# EAGLE schematic hodiny (EAGLE 7.6.0)

## Sheet 1 of 2
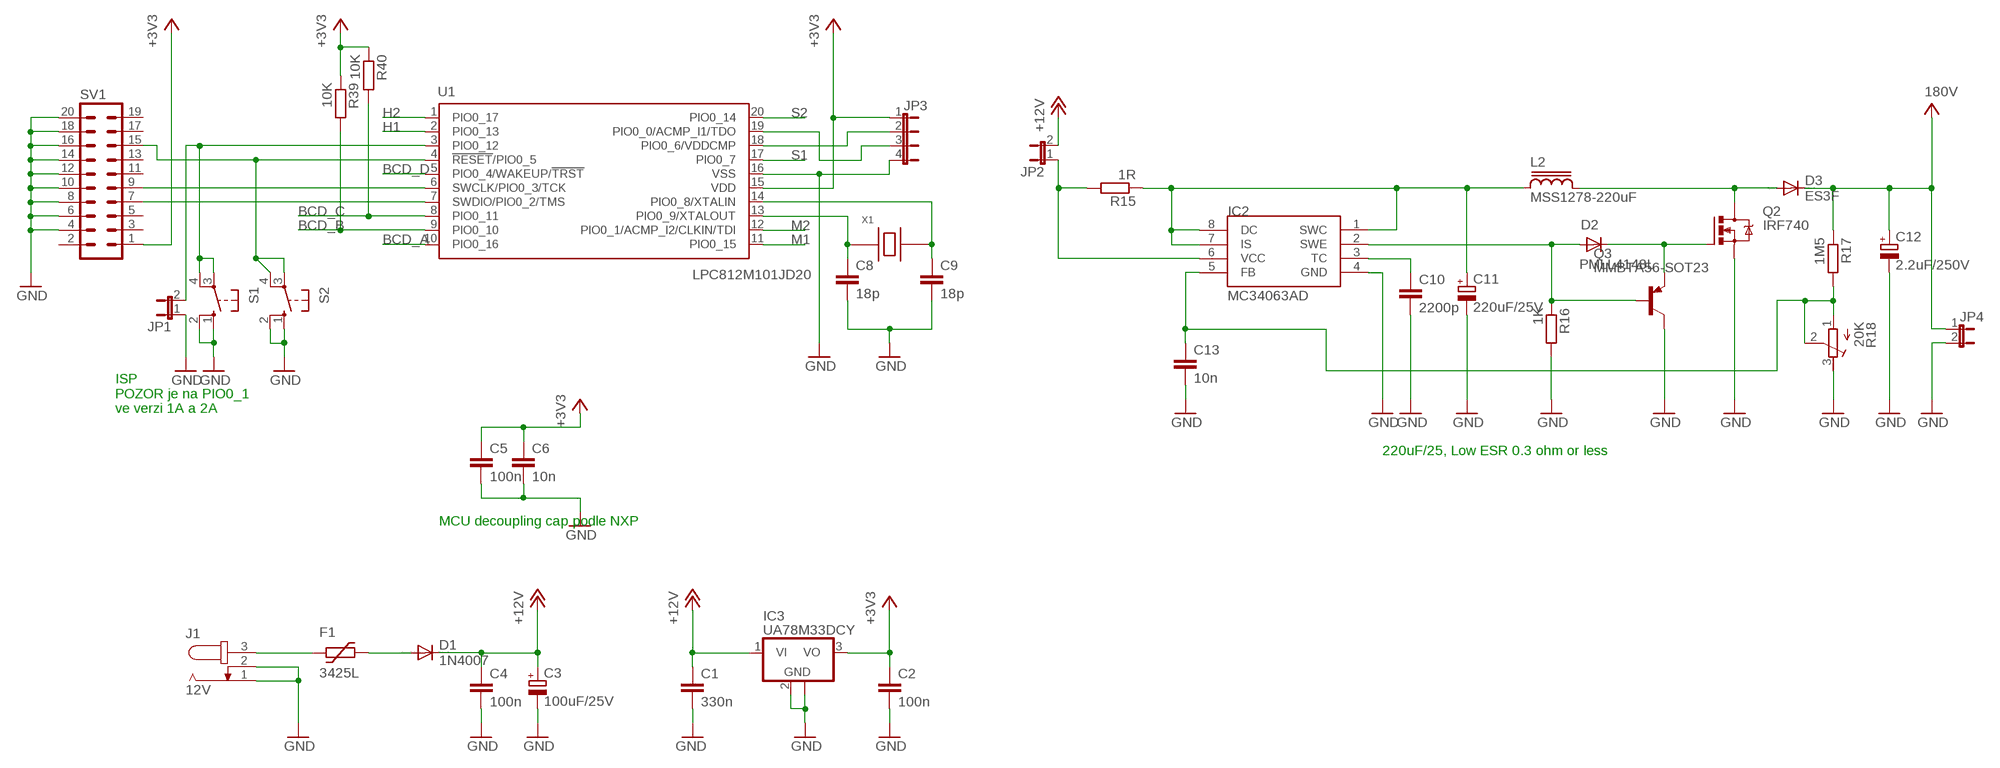
[diagram p0: schematic, sheet 1]

### Parts
C1  330n  C-EUC1206  [C1206]
C2  100n  C-EUC1206  [C1206]
C3  100uF/25V  CPOL-EU153CLV-0605  [153CLV-0605]
C4  100n  C-EUC1206  [C1206]
C5  100n  C-EUC1206  [C1206]
C6  10n  C-EUC1206  [C1206]
C8  18p  C-EUC0805  [C0805]
C9  18p  C-EUC0805  [C0805]
C10  2200p  C-EUC1206  [C1206]
C11  220uF/25V  CPOL-EU153CLV-0605  [153CLV-0605]
C12  2.2uF/250V  CPOL-EUE2.5-6  [E2,5-6]
C13  10n  C-EUC1206  [C1206]
D1  1N4007  DIODE-MELF-MLL41  [MELF-MLL41]
D2  PMLL4148L  [SOD80C]
D3  ES3F  DIODE-SMC  [SMC]
F1  3425L  [3425L]
IC2  MC34063AD  [SOIC8]
IC3  UA78M33DCY  [SOT223]
J1  12V  JACK-PLUG0  [SPC4077]
JP1  JP1E  [JP1]
JP2  JP1E  [JP1]
JP3  JP4E  [JP4]
JP4  JP1E  [JP1]
L2  MSS1278-220uF  MSS1278  [MSS1278]
Q2  IRF740  [TO220BV]
Q3  MMBTA56-SOT23  [SOT23]
R15  1R  R-EU_R1206  [R1206]
R16  1K  R-EU_R1206  [R1206]
R17  1M5  R-EU_R1206  [R1206]
R18  20K  R-TRIMMTSM53YJ  [RTRIMTSM53YJ]
R39  10K  R-EU_R1206  [R1206]
R40  10K  R-EU_R1206  [R1206]
S1  10-XX  [B3F-10XX]
S2  10-XX  [B3F-10XX]
SV1  ML20  [ML20]
U1  LPC812M101JD20  [SOT163-1]
X1  SMCE-5032  [IQG5032B]

### Nets
+3V3: C2.1 C5.1 C6.1 IC3.3(VO) JP3.1 R39.1 R40.1 SV1.1 U1.15(VDD) ; also sheet 2
+12V: C1.1 C3.+ C4.1 D1.C IC3.1(VI) JP2.2
BCD_A: U1.10(PIO0_16) ; also sheet 2
BCD_B: R39.2 U1.9(PIO0_10) ; also sheet 2
BCD_C: R40.2 U1.8(PIO0_11) ; also sheet 2
BCD_D: U1.5(PIO0_4/WAKEUP/!TRST!) ; also sheet 2
GND: C1.2 C2.2 C3.- C4.2 C5.2 C6.2 C8.2 C9.2 C10.2 C11.- C12.- C13.2 IC2.4(GND) IC3.2(GND) IC3.4(GND) J1.1 J1.2 JP1.1 JP3.4 JP4.2 Q2.S Q3.3(C) R16.2 R18.3(E) S1.1(S) S1.2(S1) S2.1(S) S2.2(S1) SV1.4 SV1.6 SV1.8 SV1.10 SV1.12 SV1.14 SV1.16 SV1.18 SV1.20 U1.16(VSS) ; also sheet 2
H1: U1.2(PIO0_13) ; also sheet 2
H2: U1.1(PIO0_17) ; also sheet 2
M1: U1.11(PIO0_15) ; also sheet 2
M2: U1.12(PIO0_1/ACMP_I2/CLKIN/TDI) ; also sheet 2
N$1: F1.P$1 J1.3
N$2: D1.A F1.P$2
N$3: S2.3(P) S2.4(P1) SV1.15 U1.4(!RESET!/PIO0_5)
N$4: JP1.2 S1.3(P) S1.4(P1) U1.3(PIO0_12)
N$5: SV1.9 U1.6(SWCLK/PIO0_3/TCK)
N$6: SV1.7 U1.7(SWDIO/PIO0_2/TMS)
N$7: C9.1 U1.14(PIO0_8/XTALIN) X1.3(PIN2)
N$8: C8.1 U1.13(PIO0_9/XTALOUT) X1.1(PIN1)
N$9: JP3.2 U1.18(PIO0_6/VDDCMP)
N$10: JP3.3 U1.19(PIO0_0/ACMP_I1/TDO)
N$39: C11.+ IC2.1(SWC) IC2.7(IS) IC2.8(DC) L2.1 R15.1
N$40: C10.1 IC2.3(TC)
N$41: D2.1(K) Q2.G Q3.2(E)
N$42: D3.A L2.2 Q2.D
N$43: D2.2(A) IC2.2(SWE) Q3.1(B) R16.1
N$45: IC2.6(VCC) JP2.1 R15.2
N$46: C13.1 IC2.5(FB) R17.2 R18.1(A) R18.2(S)
S1: U1.17(PIO0_7) ; also sheet 2
S2: U1.20(PIO0_14) ; also sheet 2
V+: C12.+ D3.C JP4.1 R17.1 ; supply symbol labelled 180V ; also sheet 2
Unconnected: SV1.2 SV1.3 SV1.5 SV1.11 SV1.13 SV1.17 SV1.19

### Notes on the sheet
- ISP
  POZOR je na PIO0_1
  ve verzi 1A a 2A
- 220uF/25, Low ESR 0.3 ohm or less
- MCU decoupling cap podle NXP

## Sheet 2 of 2
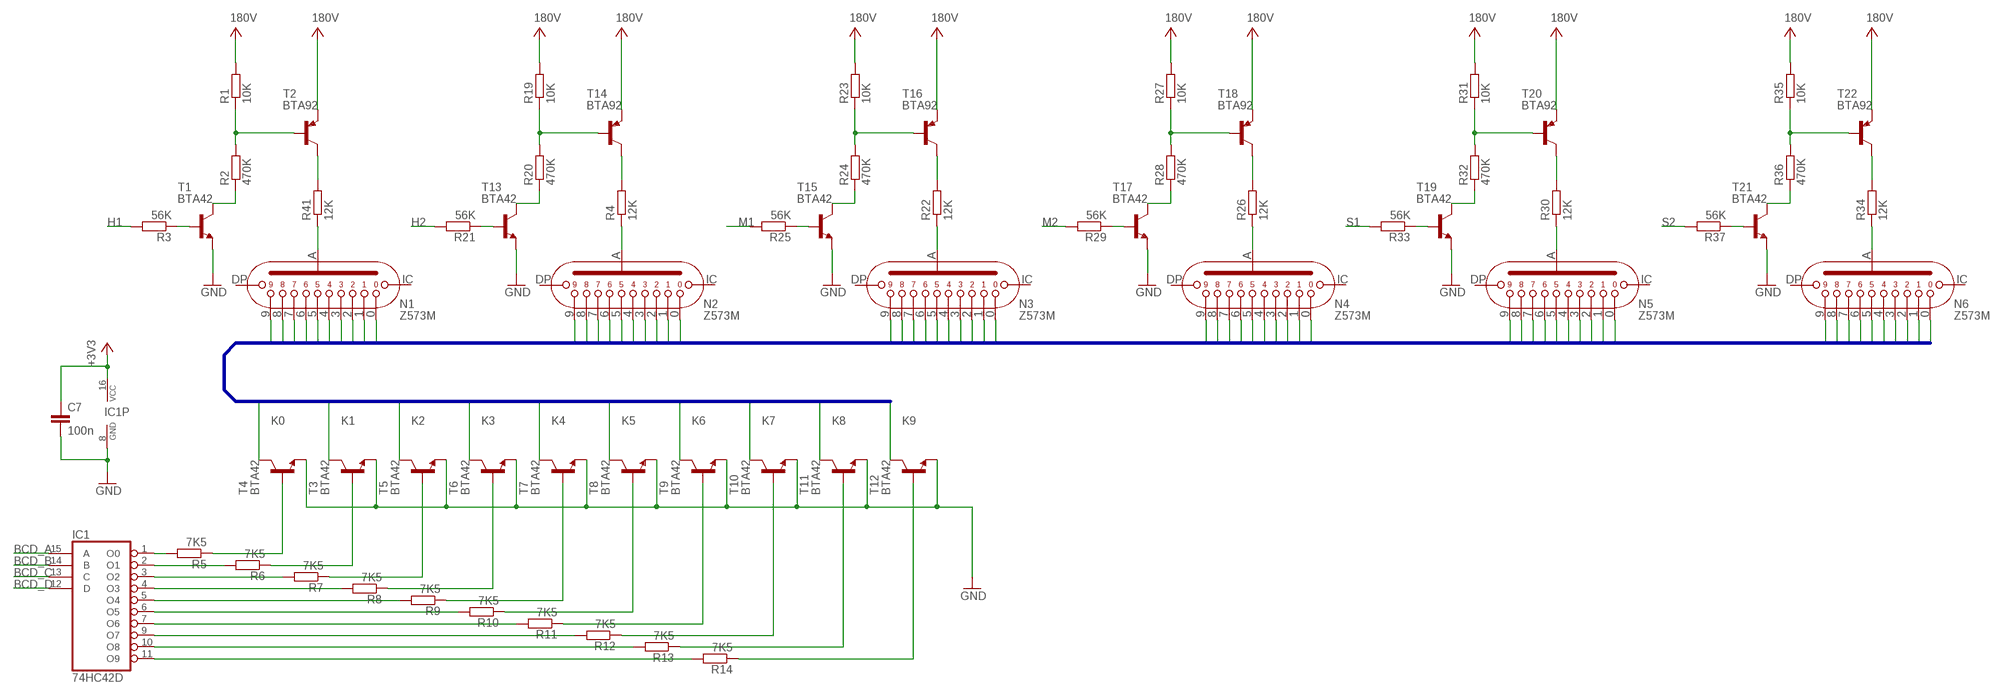
[diagram p1: schematic, sheet 2]

### Parts
C7  100n  C-EUC1206  [C1206]
IC1  74HC42D  [SO16]
N1  Z573M  [Z570M]
N2  Z573M  [Z570M]
N3  Z573M  [Z570M]
N4  Z573M  [Z570M]
N5  Z573M  [Z570M]
N6  Z573M  [Z570M]
R1  10K  R-EU_R1206  [R1206]
R2  470K  R-EU_R1206  [R1206]
R3  56K  R-EU_R1206  [R1206]
R4  12K  R-EU_0207/7  [0207/7]
R5  7K5  R-EU_R1206  [R1206]
R6  7K5  R-EU_R1206  [R1206]
R7  7K5  R-EU_R1206  [R1206]
R8  7K5  R-EU_R1206  [R1206]
R9  7K5  R-EU_R1206  [R1206]
R10  7K5  R-EU_R1206  [R1206]
R11  7K5  R-EU_R1206  [R1206]
R12  7K5  R-EU_R1206  [R1206]
R13  7K5  R-EU_R1206  [R1206]
R14  7K5  R-EU_R1206  [R1206]
R19  10K  R-EU_R1206  [R1206]
R20  470K  R-EU_R1206  [R1206]
R21  56K  R-EU_R1206  [R1206]
R22  12K  R-EU_0207/7  [0207/7]
R23  10K  R-EU_R1206  [R1206]
R24  470K  R-EU_R1206  [R1206]
R25  56K  R-EU_R1206  [R1206]
R26  12K  R-EU_0207/7  [0207/7]
R27  10K  R-EU_R1206  [R1206]
R28  470K  R-EU_R1206  [R1206]
R29  56K  R-EU_R1206  [R1206]
R30  12K  R-EU_0207/7  [0207/7]
R31  10K  R-EU_R1206  [R1206]
R32  470K  R-EU_R1206  [R1206]
R33  56K  R-EU_R1206  [R1206]
R34  12K  R-EU_0207/7  [0207/7]
R35  10K  R-EU_R1206  [R1206]
R36  470K  R-EU_R1206  [R1206]
R37  56K  R-EU_R1206  [R1206]
R41  12K  R-EU_0207/7  [0207/7]
T1  BTA42  MMBTA42LT1-NPN-SOT23-BEC  [SOT23-BEC]
T2  BTA92  MMBTA92LT1-PNP-SOT23-BEC  [SOT23-BEC]
T3  BTA42  MMBTA42LT1-NPN-SOT23-BEC  [SOT23-BEC]
T4  BTA42  MMBTA42LT1-NPN-SOT23-BEC  [SOT23-BEC]
T5  BTA42  MMBTA42LT1-NPN-SOT23-BEC  [SOT23-BEC]
T6  BTA42  MMBTA42LT1-NPN-SOT23-BEC  [SOT23-BEC]
T7  BTA42  MMBTA42LT1-NPN-SOT23-BEC  [SOT23-BEC]
T8  BTA42  MMBTA42LT1-NPN-SOT23-BEC  [SOT23-BEC]
T9  BTA42  MMBTA42LT1-NPN-SOT23-BEC  [SOT23-BEC]
T10  BTA42  MMBTA42LT1-NPN-SOT23-BEC  [SOT23-BEC]
T11  BTA42  MMBTA42LT1-NPN-SOT23-BEC  [SOT23-BEC]
T12  BTA42  MMBTA42LT1-NPN-SOT23-BEC  [SOT23-BEC]
T13  BTA42  MMBTA42LT1-NPN-SOT23-BEC  [SOT23-BEC]
T14  BTA92  MMBTA92LT1-PNP-SOT23-BEC  [SOT23-BEC]
T15  BTA42  MMBTA42LT1-NPN-SOT23-BEC  [SOT23-BEC]
T16  BTA92  MMBTA92LT1-PNP-SOT23-BEC  [SOT23-BEC]
T17  BTA42  MMBTA42LT1-NPN-SOT23-BEC  [SOT23-BEC]
T18  BTA92  MMBTA92LT1-PNP-SOT23-BEC  [SOT23-BEC]
T19  BTA42  MMBTA42LT1-NPN-SOT23-BEC  [SOT23-BEC]
T20  BTA92  MMBTA92LT1-PNP-SOT23-BEC  [SOT23-BEC]
T21  BTA42  MMBTA42LT1-NPN-SOT23-BEC  [SOT23-BEC]
T22  BTA92  MMBTA92LT1-PNP-SOT23-BEC  [SOT23-BEC]

### Nets
+3V3: C7.1 IC1.16(VCC) ; also sheet 1
BCD_A: IC1.15(A) ; also sheet 1
BCD_B: IC1.14(B) ; also sheet 1
BCD_C: IC1.13(C) ; also sheet 1
BCD_D: IC1.12(D) ; also sheet 1
GND: C7.2 IC1.8(GND) T1.E T3.E T4.E T5.E T6.E T7.E T8.E T9.E T10.E T11.E T12.E T13.E T15.E T17.E T19.E T21.E ; also sheet 1
H1: R3.2 ; also sheet 1
H2: R21.2 ; also sheet 1
K0: N1.12 N2.12 N3.12 N4.12 N5.12 N6.12 T4.C
K1: N1.1 N2.1 N3.1 N4.1 N5.1 N6.1 T3.C
K2: N1.2 N2.2 N3.2 N4.2 N5.2 N6.2 T5.C
K3: N1.3 N2.3 N3.3 N4.3 N5.3 N6.3 T6.C
K4: N1.5 N2.5 N3.5 N4.5 N5.5 N6.5 T7.C
K5: N1.6 N2.6 N3.6 N4.6 N5.6 N6.6 T8.C
K6: N1.7 N2.7 N3.7 N4.7 N5.7 N6.7 T9.C
K7: N1.8 N2.8 N3.8 N4.8 N5.8 N6.8 T10.C
K8: N1.9 N2.9 N3.9 N4.9 N5.9 N6.9 T11.C
K9: N1.11 N2.11 N3.11 N4.11 N5.11 N6.11 T12.C
M1: R25.2 ; also sheet 1
M2: R29.2 ; also sheet 1
N$12: R3.1 T1.B
N$13: R2.1 T1.C
N$14: R1.1 R2.2 T2.B
N$16: R21.1 T13.B
N$17: R41.2 T2.C
N$18: IC1.1(O0) R5.2
N$19: N1.13(A) R41.1
N$20: IC1.2(O1) R6.2
N$21: IC1.3(O2) R7.2
N$22: IC1.4(O3) R8.2
N$23: IC1.5(O4) R9.2
N$24: IC1.6(O5) R10.2
N$25: IC1.7(O6) R11.2
N$26: IC1.9(O7) R12.2
N$27: IC1.10(O8) R13.2
N$28: IC1.11(O9) R14.2
N$29: R5.1 T4.B
N$30: R6.1 T3.B
N$31: R7.1 T5.B
N$32: R8.1 T6.B
N$33: R10.1 T8.B
N$34: R11.1 T9.B
N$35: R12.1 T10.B
N$36: R13.1 T11.B
N$37: R14.1 T12.B
N$38: R9.1 T7.B
N$44: R20.1 T13.C
N$47: R19.1 R20.2 T14.B
N$48: R4.2 T14.C
N$49: N2.13(A) R4.1
N$51: R25.1 T15.B
N$52: R24.1 T15.C
N$53: R23.1 R24.2 T16.B
N$54: R22.2 T16.C
N$55: N3.13(A) R22.1
N$57: R29.1 T17.B
N$58: R28.1 T17.C
N$59: R27.1 R28.2 T18.B
N$60: R26.2 T18.C
N$61: N4.13(A) R26.1
N$63: R33.1 T19.B
N$64: R32.1 T19.C
N$65: R31.1 R32.2 T20.B
N$66: R30.2 T20.C
N$67: N5.13(A) R30.1
N$69: R37.1 T21.B
N$70: R36.1 T21.C
N$71: R35.1 R36.2 T22.B
N$72: R34.2 T22.C
N$73: N6.13(A) R34.1
S1: R33.2 ; also sheet 1
S2: R37.2 ; also sheet 1
V+: R1.2 R19.2 R23.2 R27.2 R31.2 R35.2 T2.E T14.E T16.E T18.E T20.E T22.E ; supply symbol labelled 180V ; also sheet 1
Unconnected: N1.4(IC) N1.10(DP) N2.4(IC) N2.10(DP) N3.4(IC) N3.10(DP) N4.4(IC) N4.10(DP) N5.4(IC) N5.10(DP) N6.4(IC) N6.10(DP)

### Buses
K[0..9]

## Library data of the parts
C1 C2 C4-C10 C13 = rcl:C-EU: CAPACITOR, European symbol
C3 C11 C12 = rcl:CPOL-EU: POLARIZED CAPACITOR, European symbol
D1 D3 = diode:DIODE-: DIODE
D2 = NXP_60_26022015:PMLL4148L: Single high-speed switching diodes, fabricated in planar technology, and encapsulated in small hermetically sealed glass SOD80C Surface-Mounted Device (SMD) packages. AAL Eindhoven MK; FARNELL: 1097176
F1 = ptc-littlefuse:3425L
IC1 = 74xx-eu:74*42: 4-line to 10-line DECODER (1-of-10)
IC2 = mc34063:MC34063
IC3 = linear:UA78M*: POSITIVE-VOLTAGE REGULATORS Source: http://focus.ti.com/lit/ds/symlink/ua78m33.pdf
J1 = con-jack:JACK-PLUG: DC POWER JACK Power Jack, DC, Right Angle, Through Hole, Rated 5A at 16VDC, PC Terminals Distributor: Farnell (www.Farnell.de) Drawing: 84N1161.pdf / 84N1162.pdf Manufacturer: SPC Technology (www.spctechnology.com) Type: SPC4077 / SPC 4078; OC_FARNELL: unknown; OC_NEWARK: unknown
JP1 JP2 JP4 = jumper:JP1E: JUMPER
JP3 = jumper:JP4E: JUMPER
L2 = inductor-coilcraft-3:MSS1278: SMT Power Inductor
N1-N6 = nixietubes-western:Z573M: Cold cathode, neon filled, side viewing indicator tubes. The Z573M is coated with a red filter to improve the contrast of display. Numeral height: 13 mm Minimum distance between mounting centres: 19 mm Numerals: 1 2 3 4 5 6 7 8 9 0 Decimal point: to the right of the numerals Cathode current, minimum: 1.5 mA, maximum: 2.5 mA, maximum peak: 12mA Minimum supply voltage: 170 V
Q2 = transistor-power:IRF740: N-CHANNEL MOS FET
Q3 = transistor-pnp:*-?: PNP Transistor
R1-R17 R19-R37 R39-R41 = rcl:R-EU_: RESISTOR, European symbol
R18 = rcl:R-TRIMM: Trimm resistor
S1 S2 = switch-omron:10-XX: OMRON SWITCH; MPN: B3F-1000; OC_FARNELL: 176432; OC_NEWARK: 36M3542
SV1 = con-harting-ml:ML20: HARTING; OC_FARNELL: unknown; OC_NEWARK: unknown
T1 T3-T13 T15 T17 T19 T21 = transistor:*-NPN-: NPN Transistror BF959 corrected 2008.03.06
T2 T14 T16 T18 T20 T22 = transistor:*-PNP-: PNP Transistror
U1 = NXP_60_26022015:LPC812M101: 32-bit ARM Cortex-M0+ microcontroller The LPC81xM are an ARM Cortex-M0+ based, low-cost 32-bit MCU family operating at CPU frequencies of up to 30 MHz. The LPC81xM support up to 16 kB of flash memory and 4 kB of SRAM. The peripheral complement of the LPC81xM includes a CRC engine, one I 2 C-bus interface, up to three USARTs, up to two SPI interfaces, one multi-rate timer, self wake-up timer, and state-configurable timer, one comparator, function-configurable I/O ports through a switch matrix, an input pattern match engine, and up to 18 general-purpose I/O pins. AAL Eindhoven MK; COMP: 1; FLASH: 16k; GPIO: 18; I2C: 1; SPI: 1; SRAM: 4k; USART: 2
X1 = interquip:SMCE-5032: Seam Welded Seal SMD Package SMAQ-5032 4Pads Pb-Free, RoHs Compliant Company Website:http://www.interquip.com/